# EAGLE design Interposer (EAGLE 9.5.2)
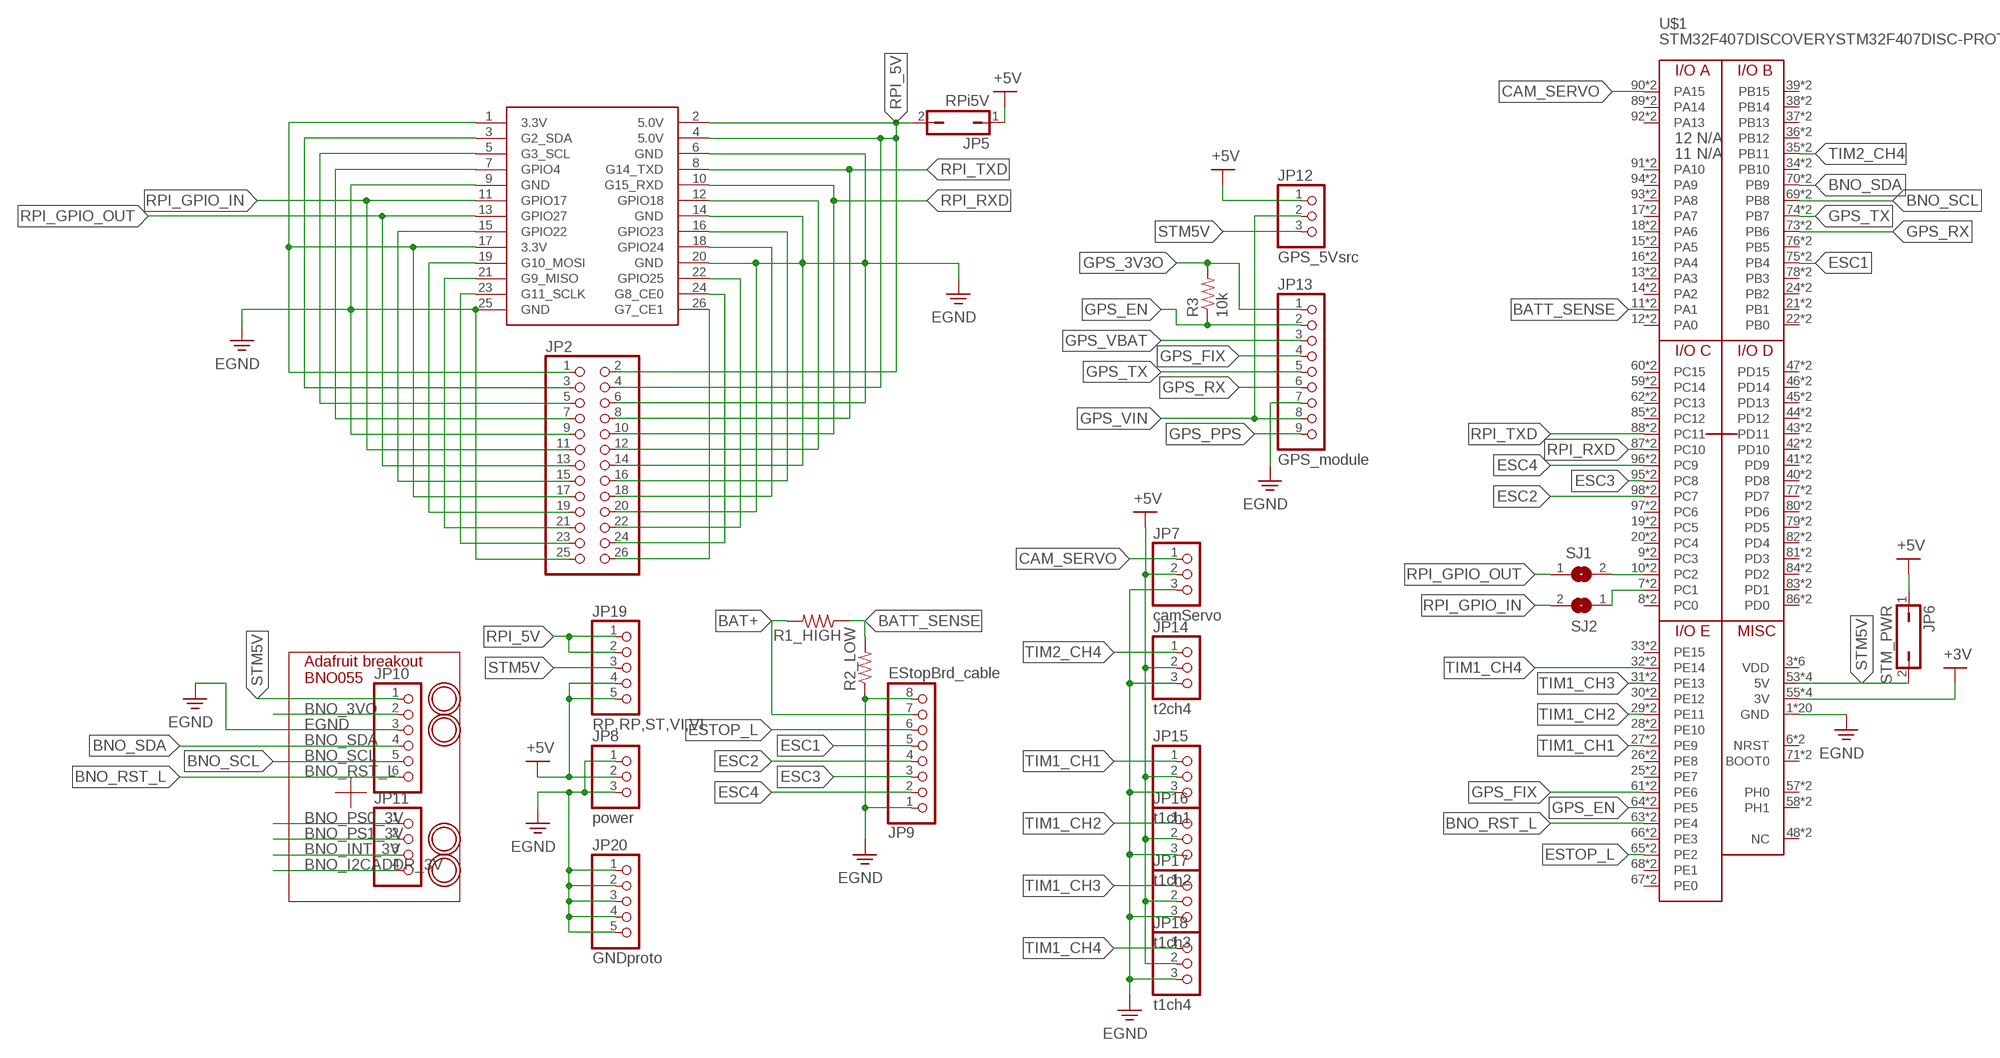
[diagram p0: schematic, sheet 1]

## Parts
JP1  MICROBUILDER_RASBERRYPI_IDC  [MICROBUILDER_RASBERRYPI_IDC]
JP2  PINHD-2X13  [2X13]
JP5  RPi5V  JP1Q  [JP1]
JP6  STM_PWR  JP1Q  [JP1]
JP7  camServo  PINHD-1X3  [1X03]
JP8  power  PINHD-1X3  [1X03]
JP9  EStopBrd_cable  PINHD-1X8_RIBBONCABLE  [1X08_RIBBONCABLE]
JP10  HEADER-1X676MIL  [1X06_ROUND_76]
JP11  HEADER-1X476MIL  [1X04_ROUND_76]
JP12  GPS_5Vsrc  PINHD-1X3  [1X03]
JP13  GPS_module  PINHD-1X9  [1X09]
JP14  t2ch4  PINHD-1X3  [1X03]
JP15  t1ch1  PINHD-1X3  [1X03]
JP16  t1ch2  PINHD-1X3  [1X03]
JP17  t1ch3  PINHD-1X3  [1X03]
JP18  t1ch4  PINHD-1X3  [1X03]
JP19  RP,RP,ST,VI,VI  PINHD-1X5  [1X05]
JP20  GNDproto  PINHD-1X5  [1X05]
R1_HIGH  R-US_0204/7  [0204/7]
R2_LOW  R-US_0204/7  [0204/7]
R3  10k  R-US_0204/7  [0204/7]
SJ1  SJ  [SJ]
SJ2  SJ  [SJ]
U$1  STM32F407DISCOVERYSTM32F407DISC-PROTO  [STM32F407DISC_WITH_PROTO_HEADERS]
U$29  MOUNTINGHOLE2.5_THICK  [MOUNTINGHOLE_2.5_PLATED_THICK]
U$30  MOUNTINGHOLE2.5_THICK  [MOUNTINGHOLE_2.5_PLATED_THICK]
U$31  MOUNTINGHOLE2.5_THICK  [MOUNTINGHOLE_2.5_PLATED_THICK]
U$32  MOUNTINGHOLE2.5_THICK  [MOUNTINGHOLE_2.5_PLATED_THICK]

## Nets
3V: U$1.55(3V) U$1.56(3V) U$1.153(3V) U$1.178(3V) ; supply symbol labelled +3V
+5V: JP5.1 JP6.1 JP7.2 JP8.2 JP12.1 JP14.2 JP15.2 JP16.2 JP17.2 JP18.2 JP19.4 JP19.5
BAT+: JP9.7 R1_HIGH.2
BATT_SENSE: R1_HIGH.1 R2_LOW.2 U$1.11(PA1) U$1.106(PA1)
BNO_3VO: JP10.2
BNO_I2CADDR_3V: JP11.4
BNO_INT_3V: JP11.3
BNO_PS0_3V: JP11.1
BNO_PS1_3V: JP11.2
BNO_RST_L: JP10.6 U$1.63(PE4) U$1.157(PE4)
BNO_SCL: JP10.5 U$1.69(PB8) U$1.160(PB8)
BNO_SDA: JP10.4 U$1.70(PB9) U$1.185(PB9)
CAM_SERVO: JP7.1 U$1.90(PA15) U$1.195(PA15)
EGND: JP1.6(GND) JP1.9(GND) JP1.14(GND) JP1.20(GND) JP1.25(GND) JP2.6 JP2.9 JP2.14 JP2.20 JP2.25 JP7.3 JP8.1 JP8.3 JP9.1 JP9.8 JP10.3 JP13.7 JP14.3 JP15.3 JP16.3 JP17.3 JP18.3 JP20.1 JP20.2 JP20.3 JP20.4 JP20.5 R2_LOW.1 U$1.1(GND) U$1.2(GND) U$1.5(GND) U$1.23(GND) U$1.49(GND) U$1.50(GND) U$1.51(GND) U$1.52(GND) U$1.99(GND) U$1.100(GND) U$1.101(GND) U$1.103(GND) U$1.112(GND) U$1.125(GND) U$1.126(GND) U$1.150(GND) U$1.151(GND) U$1.175(GND) U$1.176(GND) U$1.200(GND)
ESC1: JP9.5 U$1.75(PB4) U$1.163(PB4)
ESC2: JP9.4 U$1.98(PC7) U$1.199(PC7)
ESC3: JP9.3 U$1.95(PC8) U$1.173(PC8)
ESC4: JP9.2 U$1.96(PC9) U$1.198(PC9)
ESTOP_L: JP9.6 U$1.65(PE2) U$1.158(PE2)
GPS_3V3O: JP13.1 R3.2
GPS_EN: JP13.2 R3.1 U$1.64(PE5) U$1.182(PE5)
GPS_FIX: JP13.4 U$1.61(PE6) U$1.156(PE6)
GPS_PPS: JP13.9
GPS_RX: JP13.6 U$1.73(PB6) U$1.162(PB6)
GPS_TX: JP13.5 U$1.74(PB7) U$1.187(PB7)
GPS_VBAT: JP13.3
GPS_VIN: JP12.2 JP13.8
N$1: JP1.23(G11_SCLK) JP2.23
N$2: JP1.21(G9_MISO) JP2.21
N$3: JP1.19(G10_MOSI) JP2.19
N$4: JP1.15(GPIO22) JP2.15
N$7: JP1.7(GPIO4) JP2.7
N$8: JP1.5(G3_SCL) JP2.5
N$9: JP1.3(G2_SDA) JP2.3
N$10: JP1.26(G7_CE1) JP2.26
N$11: JP1.24(G8_CE0) JP2.24
N$12: JP1.22(GPIO25) JP2.22
N$13: JP1.18(GPIO24) JP2.18
N$14: JP1.16(GPIO23) JP2.16
N$15: JP1.12(GPIO18) JP2.12
N$16: SJ1.2 U$1.10(PC2) U$1.130(PC2)
N$17: SJ2.1 U$1.7(PC1) U$1.104(PC1)
RPI_3V3: JP1.1(3.3V) JP1.17(3.3V) JP2.1 JP2.17
RPI_5V: JP1.2(5.0V) JP1.4(5.0V) JP2.2 JP2.4 JP5.2 JP19.1 JP19.2
RPI_GPIO_IN: JP1.11(GPIO17) JP2.11 SJ2.2
RPI_GPIO_OUT: JP1.13(GPIO27) JP2.13 SJ1.1
RPI_RXD: JP1.10(G15_RXD) JP2.10 U$1.87(PC10) U$1.169(PC10)
RPI_TXD: JP1.8(G14_TXD) JP2.8 U$1.88(PC11) U$1.194(PC11)
STM5V: JP6.2 JP10.1 JP12.3 JP19.3 U$1.53(5V) U$1.54(5V) U$1.152(5V) U$1.177(5V)
TIM1_CH1: JP15.1 U$1.27(PE9) U$1.114(PE9)
TIM1_CH2: JP16.1 U$1.29(PE11) U$1.115(PE11)
TIM1_CH3: JP17.1 U$1.31(PE13) U$1.116(PE13)
TIM1_CH4: JP18.1 U$1.32(PE14) U$1.141(PE14)
TIM2_CH4: JP14.1 U$1.35(PB11) U$1.118(PB11)
Unconnected: U$1.3(VDD) U$1.4(VDD) U$1.6(NRST) U$1.8(PC0) U$1.9(PC3) U$1.12(PA0) U$1.13(PA3) U$1.14(PA2) U$1.15(PA5) U$1.16(PA4) U$1.17(PA7) U$1.18(PA6) U$1.19(PC5) U$1.20(PC4) U$1.21(PB1) U$1.22(PB0) U$1.24(PB2) U$1.25(PE7) U$1.26(PE8) U$1.28(PE10) U$1.30(PE12) U$1.33(PE15) U$1.34(PB10) U$1.36(PB12) U$1.37(PB13) U$1.38(PB14) U$1.39(PB15) U$1.40(PD8) U$1.41(PD9) U$1.42(PD10) U$1.43(PD11) U$1.44(PD12) U$1.45(PD13) U$1.46(PD14) U$1.47(PD15) U$1.48(NC) U$1.57(PH0) U$1.58(PH1) U$1.59(PC14) U$1.60(PC15) U$1.62(PC13) U$1.66(PE3) U$1.67(PE0) U$1.68(PE1) U$1.71(BOOT0) U$1.72(VDD) U$1.76(PB5) U$1.77(PD7) U$1.78(PB3) U$1.79(PD5) U$1.80(PD6) U$1.81(PD3) U$1.82(PD4) U$1.83(PD1) U$1.84(PD2) U$1.85(PC12) U$1.86(PD0) U$1.89(PA14) U$1.91(PA10) U$1.92(PA13) U$1.93(PA8) U$1.94(PA9) U$1.97(PC6) U$1.102(VDD) U$1.105(PC3) U$1.107(PA3) U$1.108(PA5) U$1.109(PA7) U$1.110(PC5) U$1.111(PB1) U$1.113(PE7) U$1.117(PE15) U$1.119(PB13) U$1.120(PB15) U$1.121(PD9) U$1.122(PD11) U$1.123(PD13) U$1.124(PD15) U$1.127(VDD) U$1.128(NRST) U$1.129(PC0) U$1.131(PA0) U$1.132(PA2) U$1.133(PA4) U$1.134(PA6) U$1.135(PC4) U$1.136(PB0) U$1.137(PB2) U$1.138(PE8) U$1.139(PE10) U$1.140(PE12) U$1.142(PB10) U$1.143(PB12) U$1.144(PB14) U$1.145(PD8) U$1.146(PD10) U$1.147(PD12) U$1.148(PD14) U$1.149(NC) U$1.154(PH0) U$1.155(PC14) U$1.159(PE0) U$1.161(BOOT0) U$1.164(PD7) U$1.165(PD5) U$1.166(PD3) U$1.167(PD1) U$1.168(PC12) U$1.170(PA14) U$1.171(PA10) U$1.172(PA8) U$1.174(PC6) U$1.179(PH1) U$1.180(PC15) U$1.181(PC13) U$1.183(PE3) U$1.184(PE1) U$1.186(VDD) U$1.188(PB5) U$1.189(PB3) U$1.190(PD6) U$1.191(PD4) U$1.192(PD2) U$1.193(PD0) U$1.196(PA13) U$1.197(PA9)

## Notes on the sheet
- Adafruit breakout
  BNO055

## Library data of the parts
JP1 = AdafruitCobbler:MICROBUILDER_RASBERRYPI_IDC: Rasberry PI IDC Header
JP2 = pinhead:PINHD-2X13: PIN HEADER
JP5 JP6 = jumper:JP1Q: JUMPER
JP7 JP14-JP18 = Interposer:PINHD-1X3: PIN HEADER
JP8 JP12 = pinhead:PINHD-1X3: PIN HEADER
JP9 = HighCurrentTransistorAndDriver:PINHD-1X8_RIBBONCABLE: PIN HEADER
JP10 = microbuilder:HEADER-1X6: PIN HEADER
JP11 = microbuilder:HEADER-1X4: PIN HEADER
JP13 = pinhead:PINHD-1X9: PIN HEADER
JP19 JP20 = Interposer:PINHD-1X5: PIN HEADER
R1_HIGH R2_LOW R3 = adafruit:R-US_: RESISTOR, American symbol
SJ1 SJ2 = jumper:SJ: SMD solder JUMPER
U$1 = Interposer:STM32F407DISCOVERY
U$29-U$32 = microbuilder:MOUNTINGHOLE: Mounting Hole For #2 screws (0.086"/2.18mm width, 0.094"/2.4mm hole) use 2.5mm; BOM: EXCLUDE

## Board
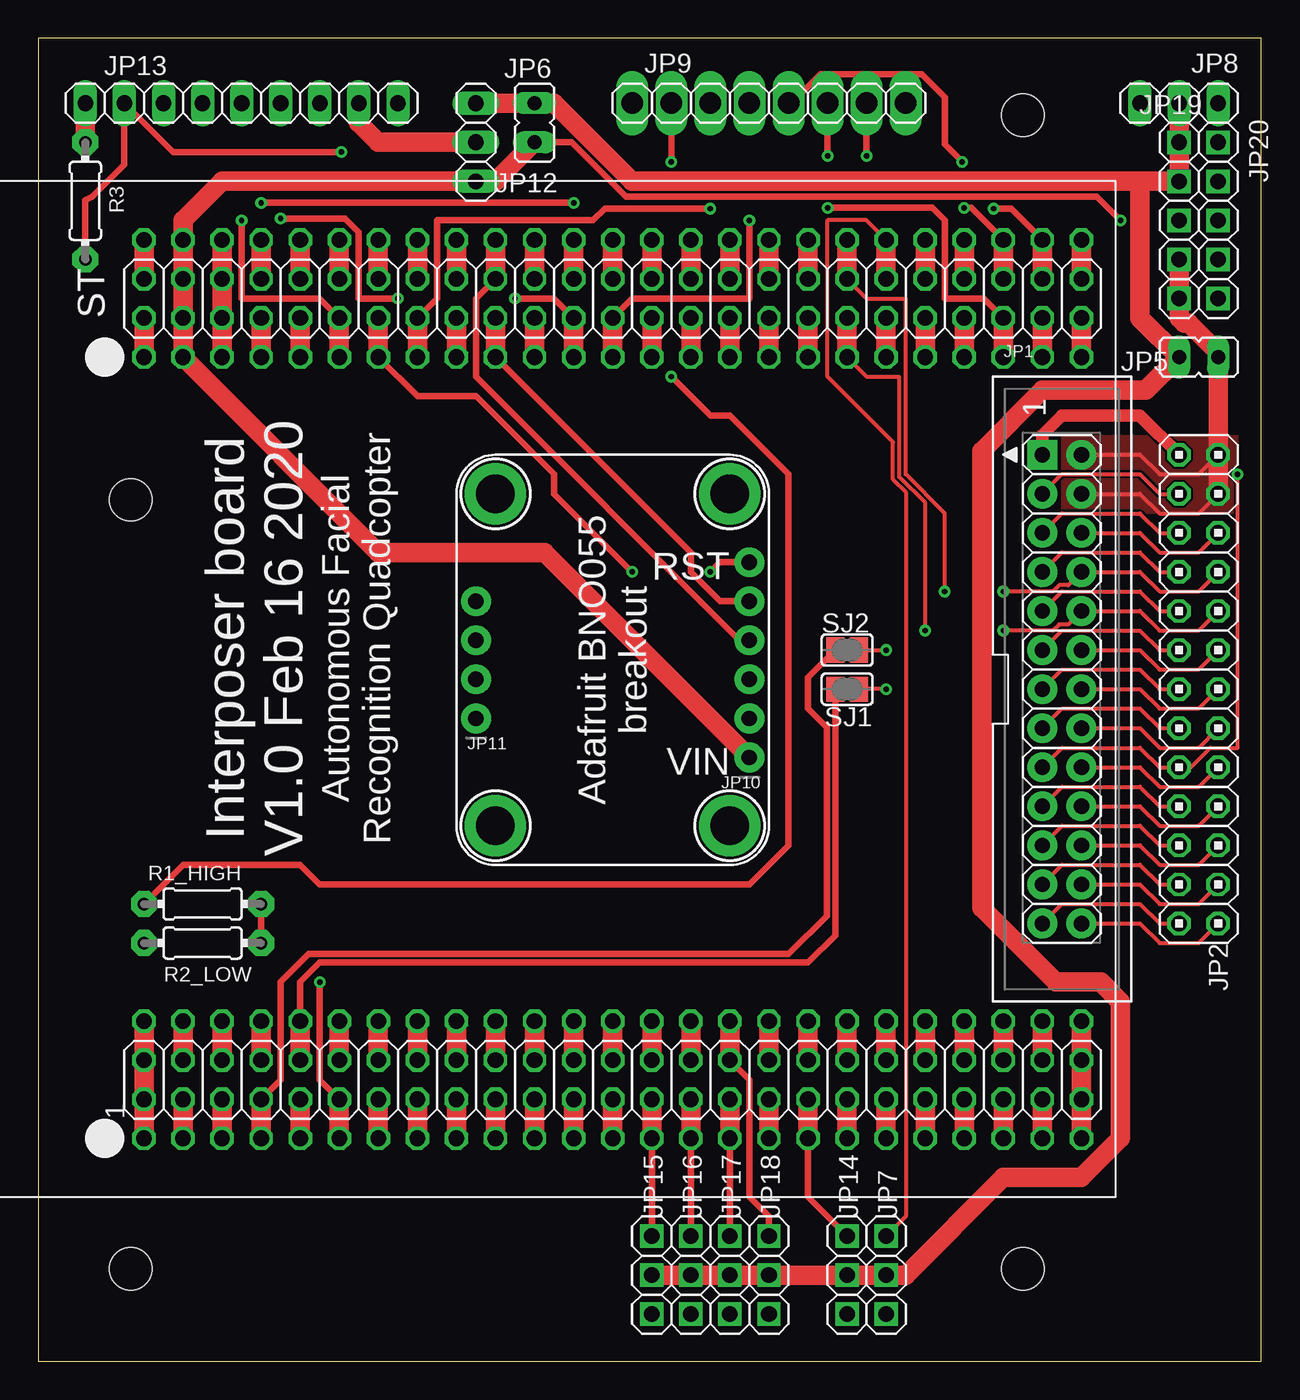
[diagram p1: board, top side]
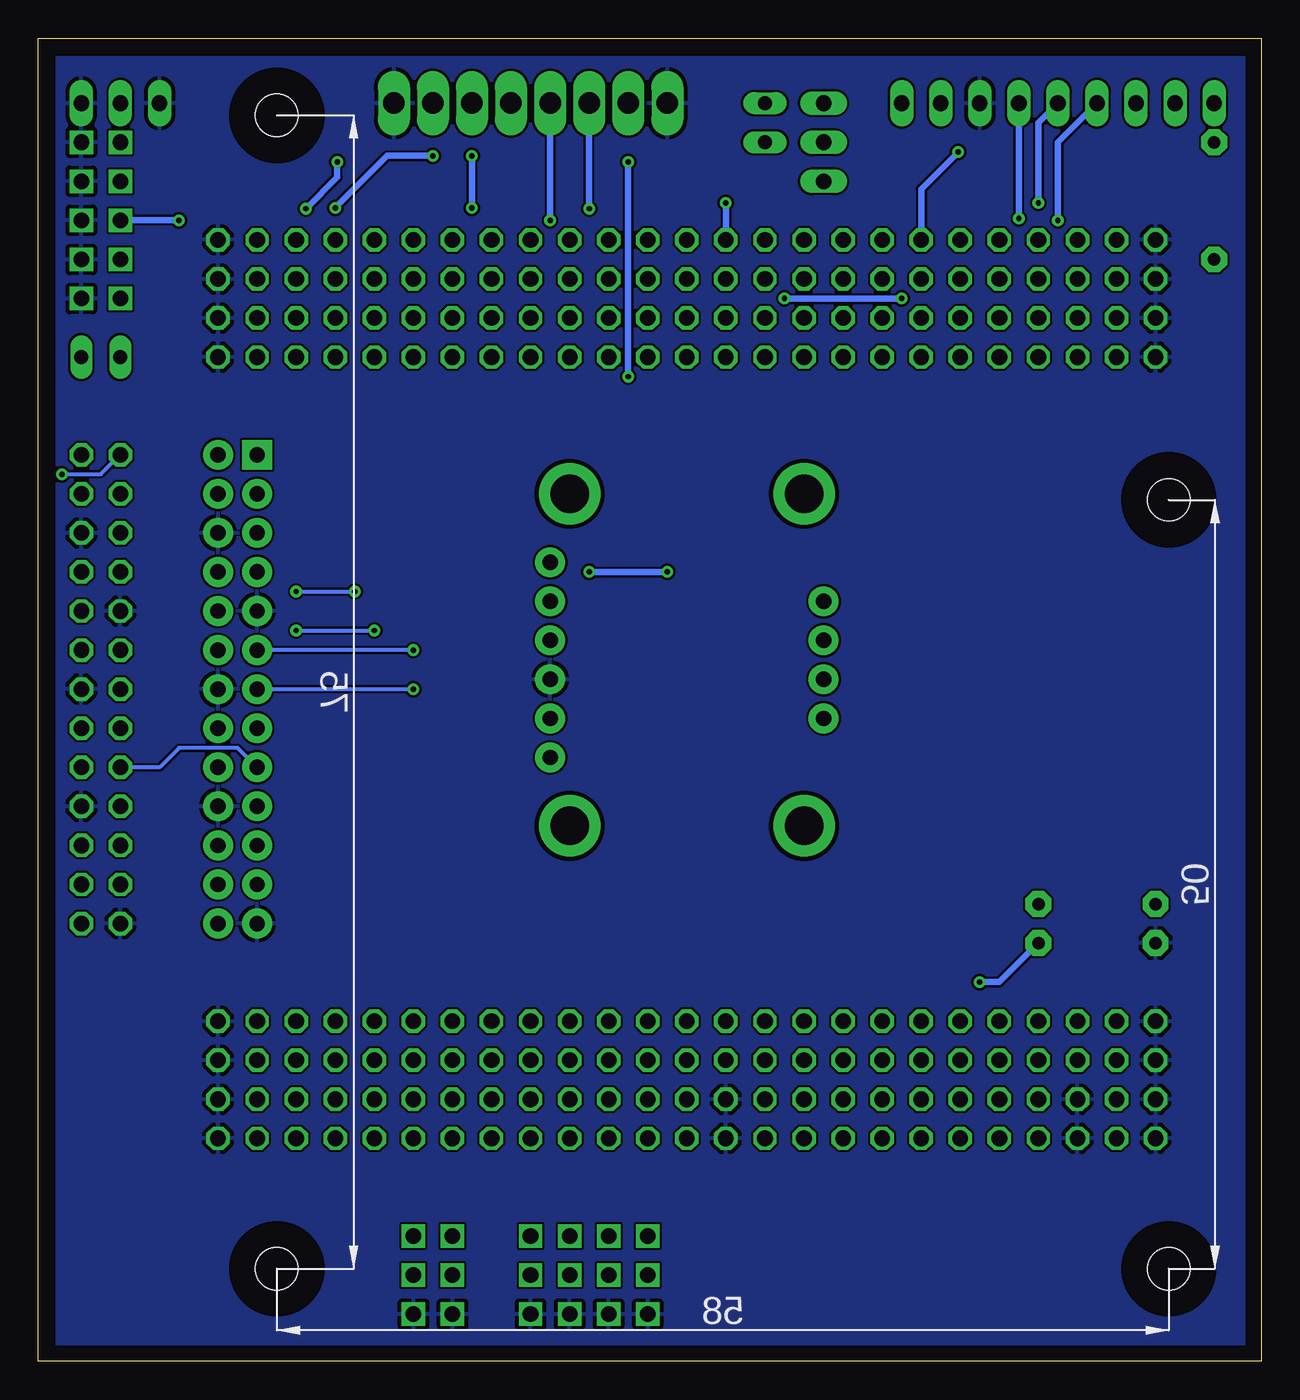
[diagram p2: board, bottom side, seen from below]

Size 79.5 x 86 mm. Coordinates in mm from the lower left corner, seen from the top.
Outline: 0,0 79.5,0 79.5,86 0,86 0,0
Copper layers (1*16): Top 0.035mm / dielectric 1.5mm / Bottom 0.035mm
Design rules "default": minimum track width 6mil, minimum drill 0.35mm, track to track 6mil, track to pad 6mil, pad to pad 6mil, via to via 6mil, smd to smd 6mil, copper to edge 40mil, drill to drill 6mil, minimum pad ring 10mil, minimum via ring 8mil, stop-mask expansion 4mil, vias tented up to drill 0mil, thermal gap 10mil

### Footprints (pad centres in the part's own frame; a part is rotated, then mirrored left to right if it is on the bottom)
MICROBUILDER_RASBERRYPI_IDC = drill 1 pad 1.93 square: 1 -1.27,15.24 | drill 1 pad 1.93: 2 1.27,15.24; 3 -1.27,12.7; 4 1.27,12.7; 5 -1.27,10.16; 6 1.27,10.16; 7 -1.27,7.62; 8 1.27,7.62; 9 -1.27,5.08; 10 1.27,5.08; 11 -1.27,2.54; 12 1.27,2.54; 13 -1.27,0; 14 1.27,0; 15 -1.27,-2.54; 16 1.27,-2.54; 17 -1.27,-5.08; 18 1.27,-5.08; 19 -1.27,-7.62; 20 1.27,-7.62; 21 -1.27,-10.16; 22 1.27,-10.16; 23 -1.27,-12.7; 24 1.27,-12.7; 25 -1.27,-15.24; 26 1.27,-15.24
2X13 = drill 1.016 octagon: 1 -15.24,-1.27; 2 -15.24,1.27; 3 -12.7,-1.27; 4 -12.7,1.27; 5 -10.16,-1.27; 6 -10.16,1.27; 7 -7.62,-1.27; 8 -7.62,1.27; 9 -5.08,-1.27; 10 -5.08,1.27; 11 -2.54,-1.27; 12 -2.54,1.27; 13 0,-1.27; 14 0,1.27; 15 2.54,-1.27; 16 2.54,1.27; 17 5.08,-1.27; 18 5.08,1.27; 19 7.62,-1.27; 20 7.62,1.27; 21 10.16,-1.27; 22 10.16,1.27; 23 12.7,-1.27; 24 12.7,1.27; 25 15.24,-1.27; 26 15.24,1.27
JP1 = drill 0.914 long: 1 0,-1.27; 2 0,1.27
1X03 = drill 1.016 square: 1 -2.54,0; 2 0,0; 3 2.54,0
1X03' = drill 1.016 long: 1 -2.54,0; 2 0,0; 3 2.54,0
1X08_RIBBONCABLE = drill 1.397 pad 1.676 long: 1 -8.89,0; 2 -6.35,0; 3 -3.81,0; 4 -1.27,0; 5 1.27,0; 6 3.81,0; 7 6.35,0; 8 8.89,0
1X06_ROUND_76 = drill 1 pad 1.93: 1 -6.35,0; 2 -3.81,0; 3 -1.27,0; 4 1.27,0; 5 3.81,0; 6 6.35,0
1X04_ROUND_76 = drill 1 pad 1.93: 1 -3.81,0; 2 -1.27,0; 3 1.27,0; 4 3.81,0
1X09 = drill 1.016 long: 1 -10.16,0; 2 -7.62,0; 3 -5.08,0; 4 -2.54,0; 5 0,0; 6 2.54,0; 7 5.08,0; 8 7.62,0; 9 10.16,0
1X05 = drill 1.016 square: 1 -5.08,0; 2 -2.54,0; 3 0,0; 4 2.54,0; 5 5.08,0
0204/7 = drill 0.813 pad 1.676 octagon: 1 -3.81,0; 2 3.81,0
SJ = smd 1.168 x 1.6: 1 -0.762,0; 2 0.762,0
STM32F407DISC_WITH_PROTO_HEADERS = drill 1.016 octagon: 1 0,0; 2 0,2.54; 3 2.54,0; 4 2.54,2.54; 5 5.08,0; 6 5.08,2.54; 7 7.62,0; 8 7.62,2.54; 9 10.16,0; 10 10.16,2.54; 11 12.7,0; 12 12.7,2.54; 13 15.24,0; 14 15.24,2.54; 15 17.78,0; 16 17.78,2.54; 17 20.32,0; 18 20.32,2.54; 19 22.86,0; 20 22.86,2.54; 21 25.4,0; 22 25.4,2.54; 23 27.94,0; 24 27.94,2.54; 25 30.48,0; 26 30.48,2.54; 27 33.02,0; 28 33.02,2.54; 29 35.56,0; 30 35.56,2.54; 31 38.1,0; 32 38.1,2.54; 33 40.64,0; 34 40.64,2.54; 35 43.18,0; 36 43.18,2.54; 37 45.72,0; 38 45.72,2.54; 39 48.26,0; 40 48.26,2.54; 41 50.8,0; 42 50.8,2.54; 43 53.34,0; 44 53.34,2.54; 45 55.88,0; 46 55.88,2.54; 47 58.42,0; 48 58.42,2.54; 49 60.96,0; 50 60.96,2.54; 51 0,50.8; 52 0,53.34; 53 2.54,50.8; 54 2.54,53.34; 55 5.08,50.8; 56 5.08,53.34; 57 7.62,50.8; 58 7.62,53.34; 59 10.16,50.8; 60 10.16,53.34; 61 12.7,50.8; 62 12.7,53.34; 63 15.24,50.8; 64 15.24,53.34; 65 17.78,50.8; 66 17.78,53.34; 67 20.32,50.8; 68 20.32,53.34; 69 22.86,50.8; 70 22.86,53.34; 71 25.4,50.8; 72 25.4,53.34; 73 27.94,50.8; 74 27.94,53.34; 75 30.48,50.8; 76 30.48,53.34; 77 33.02,50.8; 78 33.02,53.34; 79 35.56,50.8; 80 35.56,53.34; 81 38.1,50.8; 82 38.1,53.34; 83 40.64,50.8; 84 40.64,53.34; 85 43.18,50.8; 86 43.18,53.34; 87 45.72,50.8; 88 45.72,53.34; 89 48.26,50.8; 90 48.26,53.34; 91 50.8,50.8; 92 50.8,53.34; 93 53.34,50.8; 94 53.34,53.34; 95 55.88,50.8; 96 55.88,53.34; 97 58.42,50.8; 98 58.42,53.34; 99 60.96,50.8; 100 60.96,53.34; 101 0,-2.54; 102 2.54,-2.54; 103 5.08,-2.54; 104 7.62,-2.54; 105 10.16,-2.54; 106 12.7,-2.54; 107 15.24,-2.54; 108 17.78,-2.54; 109 20.32,-2.54; 110 22.86,-2.54; 111 25.4,-2.54; 112 27.94,-2.54; 113 30.48,-2.54; 114 33.02,-2.54; 115 35.56,-2.54; 116 38.1,-2.54; 117 40.64,-2.54; 118 43.18,-2.54; 119 45.72,-2.54; 120 48.26,-2.54; 121 50.8,-2.54; 122 53.34,-2.54; 123 55.88,-2.54; 124 58.42,-2.54; 125 60.96,-2.54; 126 0,5.08; 127 2.54,5.08; 128 5.08,5.08; 129 7.62,5.08; 130 10.16,5.08; 131 12.7,5.08; 132 15.24,5.08; 133 17.78,5.08; 134 20.32,5.08; 135 22.86,5.08; 136 25.4,5.08; 137 27.94,5.08; 138 30.48,5.08; 139 33.02,5.08; 140 35.56,5.08; 141 38.1,5.08; 142 40.64,5.08; 143 43.18,5.08; 144 45.72,5.08; 145 48.26,5.08; 146 50.8,5.08; 147 53.34,5.08; 148 55.88,5.08; 149 58.42,5.08; 150 60.96,5.08; 151 0,48.26; 152 2.54,48.26; 153 5.08,48.26; 154 7.62,48.26; 155 10.16,48.26; 156 12.7,48.26; 157 15.24,48.26; 158 17.78,48.26; 159 20.32,48.26; 160 22.86,48.26; 161 25.4,48.26; 162 27.94,48.26; 163 30.48,48.26; 164 33.02,48.26; 165 35.56,48.26; 166 38.1,48.26; 167 40.64,48.26; 168 43.18,48.26; 169 45.72,48.26; 170 48.26,48.26; 171 50.8,48.26; 172 53.34,48.26; 173 55.88,48.26; 174 58.42,48.26; 175 60.96,48.26; 176 0,55.88; 177 2.54,55.88; 178 5.08,55.88; 179 7.62,55.88; 180 10.16,55.88; 181 12.7,55.88; 182 15.24,55.88; 183 17.78,55.88; 184 20.32,55.88; 185 22.86,55.88; 186 25.4,55.88; 187 27.94,55.88; 188 30.48,55.88; 189 33.02,55.88; 190 35.56,55.88; 191 38.1,55.88; 192 40.64,55.88; 193 43.18,55.88; 194 45.72,55.88; 195 48.26,55.88; 196 50.8,55.88; 197 53.34,55.88; 198 55.88,55.88; 199 58.42,55.88; 200 60.96,55.88
RPI_MOUNTING_HOLE = hole 2.75: 0,0
MOUNTINGHOLE_2.5_PLATED_THICK = drill 2.5 pad 4: P$1 0,0

### Placement (x,y rotation side)
JP1  66.55,43.69 0 top
JP2  75.44,43.69 270 top
JP5  75.44,65.28 270 top
JP6  32.26,80.52 180 top
JP7  55.12,5.59 270 top
JP8  power  [1X03']  74.17,81.79 180 top
JP9  47.5,81.79 180 top
JP10  46.23,45.59 90 top
JP11  28.45,45.59 90 top
JP12  GPS_5Vsrc  [1X03']  28.45,79.25 270 top
JP13  13.21,81.79 0 top
JP14  52.58,5.59 270 top
JP15  39.88,5.59 270 top
JP16  42.42,5.59 270 top
JP17  44.96,5.59 270 top
JP18  47.5,5.59 270 top
JP19  74.17,74.17 90 top
JP20  76.71,74.17 90 top
R1_HIGH  10.67,29.72 180 top
R2_LOW  10.67,27.18 0 top
R3  3.05,75.44 90 top
SJ1  52.58,43.69 180 top
SJ2  52.58,46.23 0 top
U$1  6.86,17.02 0 top
U$2  [RPI_MOUNTING_HOLE]  6,56 90 top
U$3  [RPI_MOUNTING_HOLE]  6,6 90 top
U$4  [RPI_MOUNTING_HOLE]  64,6 90 top
U$5  [RPI_MOUNTING_HOLE]  64,81 90 top
U$29  29.72,34.8 90 top
U$30  44.96,56.39 90 top
U$31  29.72,56.39 90 top
U$32  44.96,34.8 90 top

### Tracks (layer width: path | path; a pad name or v marks a point on that pad's centre or on a via)
3V
  Top 1.27: U$1.178 U$1.56 U$1.55 U$1.153
+5V
  Top 1.27: JP15.2 JP16.2 JP17.2 JP18.2 JP14.2 JP7.2 56.39,5.59 62.74,11.94 67.82,11.94 70.36,14.48 70.36,23.37 69.09,24.64 66.17,24.64 61.34,29.47 61.34,59.18 65.28,63.12 72.01,63.12 JP5.1 71.63,67.82 71.63,76.71 | JP8.2 JP19.5 JP19.4 71.63,76.71 | 71.63,76.71 38.61,76.71 33.53,81.79 JP6.1 JP12.1
BAT+  (via drill 0.35)
  Top 0.406: JP9.7 v41.15,77.98 | v41.15,64.01 43.69,61.47 44.96,61.47 48.77,57.66 48.77,33.53 46.23,30.99 18.29,30.99 17.02,32.26 9.4,32.26 R1_HIGH.2
  Bottom 0.406: v41.15,77.98 v41.15,64.01
BATT_SENSE  (via drill 0.35)
  Top 0.406: U$1.106 U$1.11 18.29,18.29 v18.29,24.64 | R2_LOW.2 R1_HIGH.1
  Bottom 0.406: v18.29,24.64 17.02,24.64 R2_LOW.2
BNO_RST_L  (via drill 0.35)
  Top 0.406: JP10.6 44.33,51.95 v43.69,51.31 | v38.61,51.31 33.53,56.39 33.53,57.66 28.45,62.74 24.64,62.74 U$1.157 U$1.63
  Bottom 0.406: v43.69,51.31 v38.61,51.31
BNO_SCL
  Top 0.406: U$1.160 42.42,52.58 42.42,51.31 44.33,49.41 JP10.5
  Top 1.27: U$1.69 U$1.160
BNO_SDA
  Top 0.406: U$1.185 U$1.70 28.45,69.09 28.45,64.01 45.59,46.87 JP10.4
CAM_SERVO
  Top 0.254: U$1.195 53.85,74.17 51.31,74.17 51.31,64.01 55.58,59.74 55.58,57.32 56.39,56.51 56.39,9.4 JP7.1
  Top 1.27: U$1.195 U$1.90
EGND
  Top 0.254: JP1.6 71.63,53.85 72.9,52.58 75.44,52.58 JP2.6 | JP1.9 66.55,50.04 71.63,50.04 72.9,48.77 JP2.9 | JP1.14 71.63,43.69 72.9,42.42 75.44,42.42 JP2.14 | JP1.20 71.63,36.07 72.9,34.8 75.44,34.8 JP2.20 | JP1.25 66.55,29.72 71.63,29.72 72.9,28.45 JP2.25
  Top 1.27: U$1.2 U$1.1 | U$1.49 U$1.50
  pour Bottom: 0.97,0.97 78.26,0.97 78.26,84.76 0.97,84.76
ESC1  (via drill 0.35)
  Top 0.406: v46.23,74.17 46.23,69.09 38.61,69.09 U$1.75 U$1.163
  Bottom 0.406: JP9.5 v46.23,74.17
ESC2  (via drill 0.35)
  Top 0.406: U$1.98 U$1.199 63.25,74.93 v62.1,74.93 | JP9.4 48.97,81.79 50.85,83.67 57.43,83.67 58.93,82.17 58.93,79.12 v60.07,77.98
  Bottom 0.406: v62.1,74.93 60.07,76.96 v60.07,77.98
ESC3  (via drill 0.35)
  Top 0.406: U$1.173 U$1.95 61.47,69.09 58.93,69.09 58.93,74.17 58.11,74.99 v51.31,74.99 | v51.31,78.36 JP9.3
  Bottom 0.406: v51.31,74.99 v51.31,78.36
ESC4  (via drill 0.35)
  Top 0.406: U$1.96 U$1.198 60.65,74.99 v60.2,74.99 | v53.85,78.36 JP9.2
  Bottom 0.406: v60.2,74.99 56.83,78.36 v53.85,78.36
ESTOP_L  (via drill 0.35)
  Top 0.406: U$1.158 U$1.65 25.91,69.09 25.91,74.17 36.07,74.17 36.83,74.93 v43.69,74.93
  Bottom 0.406: v43.69,74.93 JP9.6
GPS_3V3O
  Top 1.27: JP13.1 R3.2
GPS_EN  (via drill 0.35)
  Top 0.406: R3.1 3.05,75.48 3.51,75.71 5.59,77.79 JP13.2 8.77,78.61 v19.69,78.61 | U$1.64 U$1.182
  Bottom 0.406: v19.69,78.61 22.1,76.2 U$1.182
GPS_FIX  (via drill 0.35)
  Top 0.406: U$1.156 U$1.61 18.29,69.09 13.21,69.09 v13.21,74.17
  Bottom 0.406: JP13.4 13.21,79.25 v13.21,74.17
GPS_RX  (via drill 0.35)
  Top 0.406: U$1.162 U$1.73 33.53,69.09 v30.99,69.09 | v23.37,69.09 20.83,69.09 20.83,73.41 19.94,74.3 v15.75,74.3
  Bottom 0.406: v30.99,69.09 v23.37,69.09 | v15.75,74.3 JP13.6
GPS_TX  (via drill 0.35)
  Top 0.406: v14.48,75.31 v34.8,75.31
  Top 1.27: U$1.187 U$1.74
  Bottom 0.406: JP13.5 14.48,80.52 v14.48,75.31 | v34.8,75.31 U$1.187
GPS_VIN
  Top 1.27: JP12.2 22.1,79.25 20.83,80.52 JP13.8
N$1
  Top 0.254: JP1.23 66.55,32.26 71.63,32.26 72.9,30.99 JP2.23
N$2
  Top 0.254: JP1.21 66.55,34.8 71.63,34.8 72.9,33.53 JP2.21
N$3
  Top 0.254: JP1.19 66.55,37.34 71.63,37.34 72.9,36.07 JP2.19
N$4
  Top 0.254: JP1.15 66.55,42.42 71.63,42.42 72.9,41.15 JP2.15
N$7
  Top 0.254: JP1.7 66.55,52.58 71.63,52.58 72.9,51.31 JP2.7
N$8
  Top 0.254: JP1.5 66.55,55.12 71.63,55.12 72.9,53.85 JP2.5
N$9
  Top 0.254: JP1.3 66.55,57.66 71.63,57.66 72.9,56.39 JP2.3
N$10
  Top 0.254: JP1.26 71.63,28.45 72.9,27.18 75.44,27.18 JP2.26
N$11
  Top 0.254: JP1.24 71.63,30.99 72.9,29.72 75.44,29.72 JP2.24
N$12
  Top 0.254: JP1.22 71.63,33.53 72.9,32.26 75.44,32.26 JP2.22
N$13
  Top 0.254: JP1.18 71.63,38.61 72.9,37.34 75.44,37.34 JP2.18
N$14
  Top 0.254: JP1.16 71.63,41.15 72.9,39.88 75.44,39.88 JP2.16
N$15
  Top 0.254: JP1.12 71.63,46.23 72.9,44.96 75.44,44.96 JP2.12
N$16
  Top 0.406: SJ1.2 51.82,27.69 50.04,25.91 18.29,25.91 17.02,24.64 U$1.130 U$1.10
N$17
  Top 0.406: SJ2.1 50.04,44.45 50.04,42.42 51.26,41.2 51.26,28.96 48.77,26.47 17.58,26.47 15.75,24.64 15.75,18.29 U$1.7 U$1.104
RPI_3V3  (via drill 0.35)
  Top 0.254: JP1.17 66.55,39.88 71.63,39.88 72.9,38.61 JP2.17 74.93,38.61 76.2,39.88 77.98,39.88 v77.98,57.66
  Top 0.813: JP1.1 65.28,60.2 66.55,61.47 71.63,61.47 JP2.1
  Bottom 0.254: JP1.17 66.55,39.88 70.36,39.88 71.63,38.61 JP2.17 | v77.98,57.66 75.44,57.66 JP2.1
RPI_5V
  Top 0.254: JP1.2 71.63,58.93 72.9,57.66 75.44,57.66 JP2.2 | JP1.4 71.63,56.39 72.9,55.12 75.44,55.12 JP2.4
  Top 1.27: JP19.2 JP19.1 74.17,67.82 74.5,67.49 74.79,67.49 76.71,65.57 JP5.2 JP2.2 JP2.4
  pour Top (no thermals): 66.55,55.12 66.55,60.2 77.98,60.2 77.98,55.12
RPI_GPIO_IN  (via drill 0.35)
  Top 0.254: JP1.11 66.55,47.5 71.63,47.5 72.9,46.23 JP2.11 | SJ2.2 v55.12,46.23
  Bottom 0.254: v55.12,46.23 JP1.11
RPI_GPIO_OUT  (via drill 0.35)
  Top 0.254: JP1.13 66.55,44.96 71.63,44.96 72.9,43.69 JP2.13 | v55.12,43.69 SJ1.1
  Bottom 0.254: JP1.13 v55.12,43.69
RPI_RXD  (via drill 0.35)
  Top 0.254: JP2.10 75.44,47.5 72.9,47.5 71.63,48.77 JP1.10 66.96,47.91 66.38,47.91 65.97,47.5 v62.74,47.5 | U$1.169 53.85,64.01 55.98,64.01 55.98,57.49 57.66,55.81 v57.66,47.5
  Top 1.27: U$1.87 U$1.169
  Bottom 0.254: v62.74,47.5 v57.66,47.5
RPI_TXD  (via drill 0.35)
  Top 0.254: JP2.8 75.44,50.04 72.9,50.04 71.63,51.31 JP1.8 66.96,50.45 66.38,50.45 65.97,50.04 v62.74,50.04 | U$1.88 53.85,69.09 56.39,69.09 56.39,57.66 58.93,55.12 v58.93,50.04
  Top 0.406: U$1.88 U$1.194
  Bottom 0.254: v62.74,50.04 v58.93,50.04
STM5V  (via drill 0.35)
  Top 0.406: JP6.2 34.67,79.25 38.2,75.72 68.81,75.72 v70.36,74.17
  Top 1.27: JP6.2 29.72,76.71 JP12.3 11.94,76.71 9.4,74.17 U$1.177 U$1.54 U$1.53 U$1.152 22.1,52.58 32.9,52.58 JP10.1
  Bottom 0.406: v70.36,74.17 JP19.3
TIM1_CH1
  Top 0.406: U$1.27 U$1.114 JP15.1
TIM1_CH2
  Top 0.406: U$1.29 U$1.115 JP16.1
TIM1_CH3
  Top 0.406: U$1.31 U$1.116 JP17.1
TIM1_CH4
  Top 0.406: U$1.141 U$1.32 46.23,18.29 46.23,10.67 47.5,9.4 JP18.1
TIM2_CH4
  Top 0.406: U$1.35 U$1.118 50.04,10.67 JP14.1

### Text on the board
tPlace: RST | Interposer board / V1.0 Feb 16 2020 | Autonomous Facial / Recognition Quadcopter | Adafruit BNO055 / breakout | VIN